# Altium schematic sheet Connector.SchDoc
size A; SheetNumber: 2; SheetTotal: 5
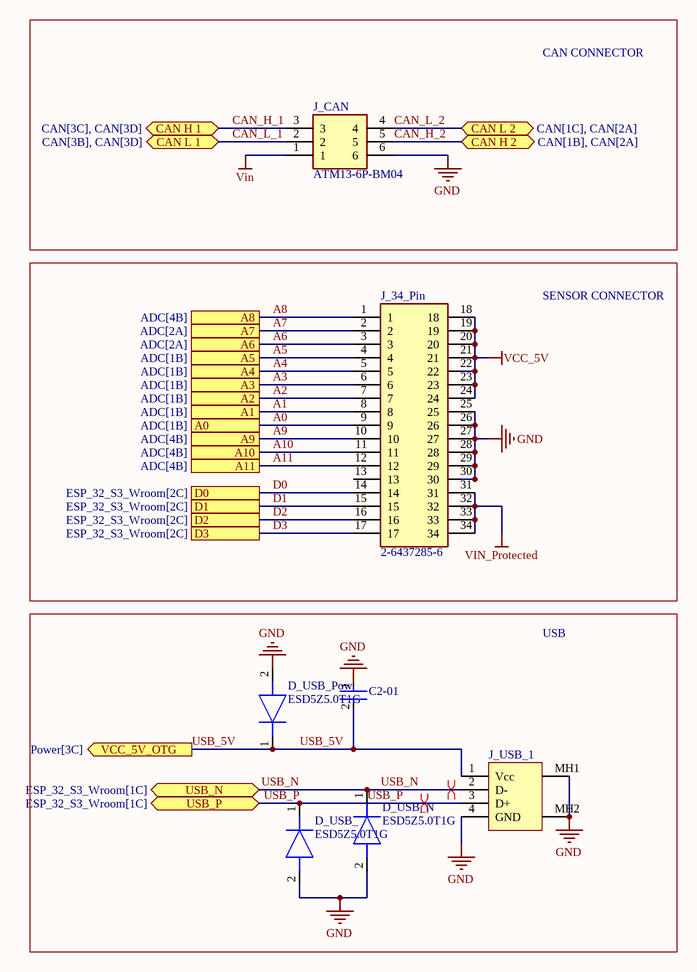
[diagram p0: Connector.SchDoc]

## Parts
C2-01  GRM21BZ71E106KE15L  [FP-GRM21B-0_2-e0_2_0_7-IPC_B]  (value not drawn)
D_USB_  ESD5Z5.0T1G  [SODFL1608X70N]
D_USB_N  ESD5Z5.0T1G  [SODFL1608X70N]
D_USB_Pow  ESD5Z5.0T1G  [SODFL1608X70N]
J_34_Pin  2-6437285-6  [264372856]
J_CAN  ATM13-6P-BM04  [ATM136PBM04]
J_USB_1  61729-0010BLF  [FCI-61729-0010BLF-6_V]  (value not drawn)

## Blocks framed on the sheet
CAN CONNECTOR: J_CAN
SENSOR CONNECTOR: J_34_Pin
USB: C2-01 D_USB_ D_USB_N D_USB_Pow J_USB_1

## Ports
A0 (see ADC[1B]), A1 (see ADC[1B]), A2 (see ADC[1B]), A3 (see ADC[1B]), A4 (see ADC[1B]), A5 (see ADC[1B]), A6 (see ADC[2A]), A7 (see ADC[2A]), A8 (see ADC[4B]), A9 (see ADC[4B]), A10 (see ADC[4B]), A11 (see ADC[4B]), CAN H 1 (bidir, see CAN[3C], CAN[3D]), CAN H 2 (bidir, see CAN[1B], CAN[2A]), CAN L 1 (bidir, see CAN[3B], CAN[3D]), CAN L 2 (bidir, see CAN[1C], CAN[2A]), D0 (see ESP_32_S3_Wroom[2C]), D1 (see ESP_32_S3_Wroom[2C]), D2 (see ESP_32_S3_Wroom[2C]), D3 (see ESP_32_S3_Wroom[2C]), USB_N (bidir, see ESP_32_S3_Wroom[1C]), USB_P (bidir, see ESP_32_S3_Wroom[1C]), VCC_5V_OTG (out, see Power[3C])

## Nets
GND: C2-01.1 D_USB_.2(A) D_USB_N.2(A) D_USB_Pow.2(A) J_34_Pin.25 J_34_Pin.26 J_34_Pin.27 J_34_Pin.28 J_34_Pin.29 J_34_Pin.30 J_CAN.6 J_USB_1.4(GND) J_USB_1.MH1 J_USB_1.MH2
VCC_5V: J_34_Pin.18 J_34_Pin.19 J_34_Pin.20 J_34_Pin.21 J_34_Pin.22 J_34_Pin.23 J_34_Pin.24
Vin: J_CAN.1
VIN_Protected: J_34_Pin.31 J_34_Pin.32 J_34_Pin.33 J_34_Pin.34
A0: J_34_Pin.9 ; port A0
A1: J_34_Pin.8 ; port A1
A2: J_34_Pin.7 ; port A2
A3: J_34_Pin.6 ; port A3
A4: J_34_Pin.5 ; port A4
A5: J_34_Pin.4 ; port A5
A6: J_34_Pin.3 ; port A6
A7: J_34_Pin.2 ; port A7
A8: J_34_Pin.1 ; port A8
A9: J_34_Pin.10 ; port A9
A10: J_34_Pin.11 ; port A10
A11: J_34_Pin.12 ; port A11
CAN_H_1: J_CAN.3 ; port CAN H 1
CAN_H_2: J_CAN.5 ; port CAN H 2
CAN_L_1: J_CAN.2 ; port CAN L 1
CAN_L_2: J_CAN.4 ; port CAN L 2
D0: J_34_Pin.14 ; port D0
D1: J_34_Pin.15 ; port D1
D2: J_34_Pin.16 ; port D2
D3: J_34_Pin.17 ; port D3
USB_5V: C2-01.2 D_USB_Pow.1(K) J_USB_1.1(Vcc) ; port VCC_5V_OTG
USB_N: D_USB_N.1(K) J_USB_1.2(D-) ; port USB_N
USB_P: D_USB_.1(K) J_USB_1.3(D+) ; port USB_P

Not connected (* = marked no-connect by the designer): J_34_Pin 13

## Layout directives
differential pair: USB_N, USB_P

## Library data of the parts
C2-01 = CMP-06035-047417-1: Chip Multilayer Ceramic Capacitors for General Purpose, 0805, 10uF, X7R, 15%, 10%, 25V
D_USB_ D_USB_N D_USB_Pow = ESD5Z5.0T1G: Diode; Manufacturer_Name: onsemi; Datasheet Link: https://www.onsemi.com/pub/Collateral/ESD5Z2.5T1-D.PDF; Height: 0.7mm; Manufacturer_Part_Number: ESD5Z5.0T1G; Mouser Part Number: 863-ESD5Z5.0T1G; Mouser Price/Stock: https://www.mouser.co.uk/ProductDetail/onsemi/ESD5Z5.0T1G?qs=OSf9jACorvYw3fDx1S8P6A%3D%3D; Arrow Part Number: ESD5Z5.0T1G; Arrow Price/Stock: https://www.arrow.com/en/products/esd5z5.0t1g/on-semiconductor?utm_currency=USD&region=nac
J_34_Pin = 2-6437285-6: Connector; Manufacturer_Name: TE Connectivity; Datasheet Link: https://www.te.com/commerce/DocumentDelivery/DDEController?Action=srchrtrv&DocNm=1-1773950-7&DocType=Data%20Sheet&DocLang=English&PartCntxt=2-6437285-6&DocFormat=pdf; Height: 28.2mm; Manufacturer_Part_Number: 2-6437285-6; Mouser Part Number: 571-2-6437285-6; Mouser Price/Stock: https://www.mouser.co.uk/ProductDetail/TE-Connectivity/2-6437285-6?qs=XhI5AayaxxVT19QQsb3foA%3D%3D
J_CAN = CMP-002-00005-1: Connector; Manufacturer_Name: Amphenol Sine Systems; Manufacturer_Part_Number: ATM13-6P-BM04; Datasheet Link: https://www.amphenol-sine.com/pdf/datasheet/ATM13-6P-BM04.pdf; Mouser Part Number: 654-ATM13-6P-BM04; Design Item ID: ATM13-6P-BM04; Mouser Price/Stock: https://www.mouser.co.uk/ProductDetail/Amphenol-SINE-Systems/ATM13-6P-BM04?qs=0lSvoLzn4L8DozrFrx2CGw%3D%3D; Source: SamacSys.SchLib; Arrow Part Number: ATM13-6P-BM04; Height: 33.4mm; Arrow Price/Stock: https://www.arrow.com/en/products/atm13-6p-bm04/amphenol?region=nac
J_USB_1 = CMP-0397-00002-2: Single USB 2.0, B Type, Right Angle Jack, Through Hole, RoHS, Tube; Manufacturer: FCI Electronics; Number of Contacts: 4; Gender: Receptacle; Specifications: USB 2.0; Connector Type: USB-B; ComponentLink1URL: http://portal.fciconnect.com/; DatasheetVersion: Rev. V; PartNumber: 61729-0010BLF; ComponentLink3Description: Package Specification; PackageDescription: 6-Pin, Through Hole, Body 12.2 x 16 mm; Packing: Tube; ComponentLink2Description: Datasheet; Mounting Technology: Through Hole; PackageReference: 61729-0010BLF; ComponentLink1Description: Manufacturer URL; ComponentLink3URL: http://portal.fciconnect.com/Comergent//fci/drawing/61729.pdf; ComponentLink2URL: http://portal.fciconnect.com/Comergent//fci/drawing/61729.pdf; RoHS: TRUE